# EAGLE design 2MosfetV2 (EAGLE 9.3.0)
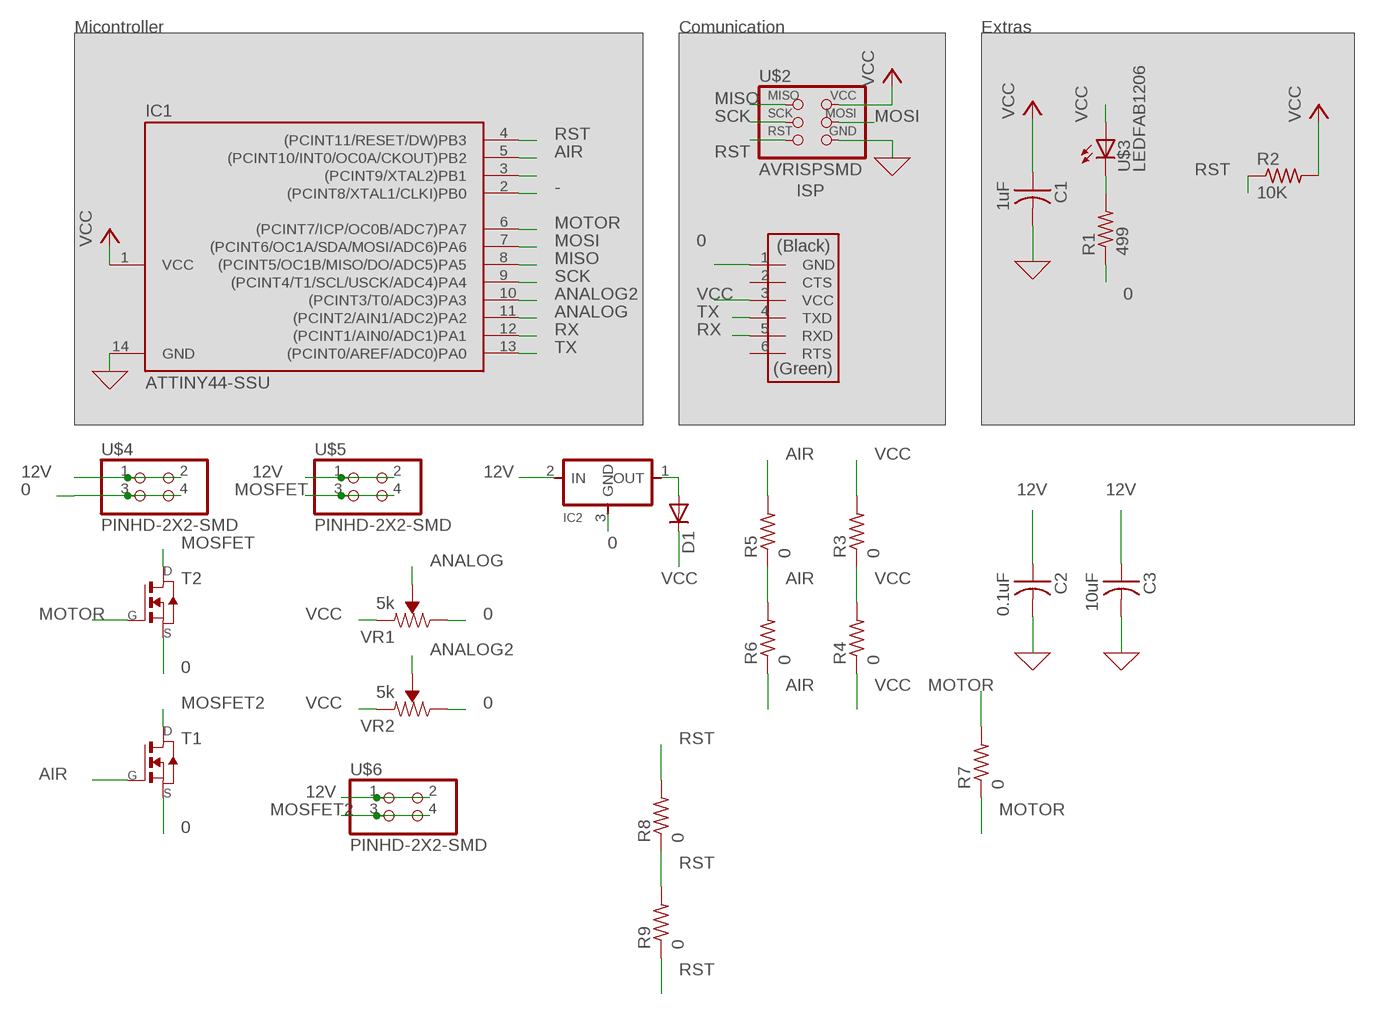
[diagram p0: schematic, sheet 1]

## Parts
C1  1uF  CAP-US1206FAB  [C1206FAB]
C2  0.1uF  CAP-US1206FAB  [C1206FAB]
C3  10uF  CAP-US1206FAB  [C1206FAB]
D1  DIODESOD123  [SOD123]
IC1  ATTINY44-SSU  [SOIC14]
IC2  REGULATORSOT23  [SOT23]
R1  499  RES-US1206FAB  [R1206FAB]
R2  10K  RES-US1206FAB  [R1206FAB]
R3  0  RES-US1206FAB  [R1206FAB]
R4  0  RES-US1206FAB  [R1206FAB]
R5  0  RES-US1206FAB  [R1206FAB]
R6  0  RES-US1206FAB  [R1206FAB]
R7  0  RES-US1206FAB  [R1206FAB]
R8  0  RES-US1206FAB  [R1206FAB]
R9  0  RES-US1206FAB  [R1206FAB]
T1  NMOSFETTO252  [TO252]
T2  NMOSFETTO252  [TO252]
U$1  FTDI-SMD-HEADER  [1X06SMD]
U$2  AVRISPSMD  [2X03SMD]
U$3  LEDFAB1206  [LED1206FAB]
U$4  PINHD-2X2-SMD  [2X02SMD]
U$5  PINHD-2X2-SMD  [2X02SMD]
U$6  PINHD-2X2-SMD  [2X02SMD]
VR1  5k  TRIMPOT-SMD-5MM-CLOSED-1/4W-20%  [TRIMPOT-SMD-5MM]
VR2  5k  TRIMPOT-SMD-5MM-CLOSED-1/4W-20%  [TRIMPOT-SMD-5MM]

## Nets
0: C1.2 C2.2 C3.2 IC1.14(GND) IC2.3(GND) R1.1 T1.2(S) T2.2(S) U$1.1(GND) U$2.6(GND) U$4.3 U$4.4 VR1.C(CW) VR2.C(CW) ; supply symbol labelled GND
12V: C2.1 C3.1 IC2.2(IN) U$4.1 U$4.2 U$5.1 U$5.2 U$6.1 U$6.2
-: IC1.2((PCINT8/XTAL1/CLKI)PB0)
AIR: IC1.5((PCINT10/INT0/OC0A/CKOUT)PB2) R5.1 R5.2 R6.1 R6.2 T1.1(G)
ANALOG: IC1.11((PCINT2/AIN1/ADC2)PA2) VR1.B(WIPER)
ANALOG2: IC1.10((PCINT3/T0/ADC3)PA3) VR2.B(WIPER)
MISO: IC1.8((PCINT5/OC1B/MISO/DO/ADC5)PA5) U$2.1(MISO)
MOSFET: T2.3(D) U$5.3 U$5.4
MOSFET2: T1.3(D) U$6.3 U$6.4
MOSI: IC1.7((PCINT6/OC1A/SDA/MOSI/ADC6)PA6) U$2.4(MOSI)
MOTOR: IC1.6((PCINT7/ICP/OC0B/ADC7)PA7) R7.1 R7.2 T2.1(G)
N$1: R1.2 U$3.2(C)
N$6: IC1.3((PCINT9/XTAL2)PB1)
N$11: D1.ANODE(A) IC2.1(OUT)
RST: IC1.4((PCINT11/RESET/DW)PB3) R2.1 R8.1 R8.2 R9.1 R9.2 U$2.5(RST)
RX: IC1.12((PCINT1/AIN0/ADC1)PA1) U$1.5(RXD)
SCK: IC1.9((PCINT4/T1/SCL/USCK/ADC4)PA4) U$2.3(SCK)
TX: IC1.13((PCINT0/AREF/ADC0)PA0) U$1.4(TXD)
VCC: C1.1 D1.CATHODE(C) IC1.1(VCC) R2.2 R3.1 R3.2 R4.1 R4.2 U$1.3(VCC) U$2.2(VCC) U$3.1(A) VR1.A(CCW) VR2.A(CCW)
Unconnected: U$1.2(CTS) U$1.6(RTS)

## Notes on the sheet
- Micontroller | Comunication | Extras
- ISP

## Library data of the parts
C1-C3 = fab:CAP-US
D1 = fab:DIODE: DIODE high speed (Philips)
IC1 = fab:ATTINY44
IC2 = fab:REGULATOR
R1-R9 = fab:RES-US: Resistor (US Symbol) Variants with postfix FAB are widened to allow the routing of internal traces
T1 T2 = fab:NMOSFET: MOS FET
U$1 = fab:FTDI-SMD-HEADER
U$2 = fab:AVRISP
U$3 = fab:LED: LED
U$4-U$6 = fab:PINHD-2X2-SMD
VR1 VR2 = SparkFun-Resistors:TRIMPOT: Trimming Potentiometer (Trimpot) Three-terminal potentiometers, with an adjustable wiper and two adjustable resistors. A pot can be used to create a configurable voltage divider, or as a variable resistor. "Trimpots" are a subset of potentiometers, usually intended for "set-and-forget" applications. They're often more delicate than standard potentiometers - rated for fewer turns. Variants PTH-KNOB - PTH Trimpot w/ finger-adjustable knob Trimpot 10K with Knob <https://www.sparkfun.com/products/9806> (COM-09806) Datasheet <http://www.sparkfun.com/datasheets/Components/General/TSR-3386.pdf> SMD-3MM-CLOSED-FRAME - SMD 3mm Square Closed-Frame Trimpot Used on e.g. EasyDriver - Stepper Motor Driver <https://www.sparkfun.com/products/12779> Datasheet <http://www.bitechnologies.com/pdfs/22.pdf> (22AR10KTR) SMD-5MM - SMD 5mm Square Closed-Frame Trimpot Used on e.g. IOIO-OTG - V2.2 <https://www.sparkfun.com/products/13613> Datasheet <http://www.vishay.com/docs/51008/ts53.pdf> (TS53YL502MR10) SMD-3MM-1/10W-25% - 3mm Square Open-Frame Trimpot Used on e.g. SparkFun Shapeoko <https://www.sparkfun.com/products/13899> Datasheet <http://www.bourns.com/docs/Product-Datasheets/TC33.pdf> (TC33X-2-103E); PROD_ID: RES-11156

## Board
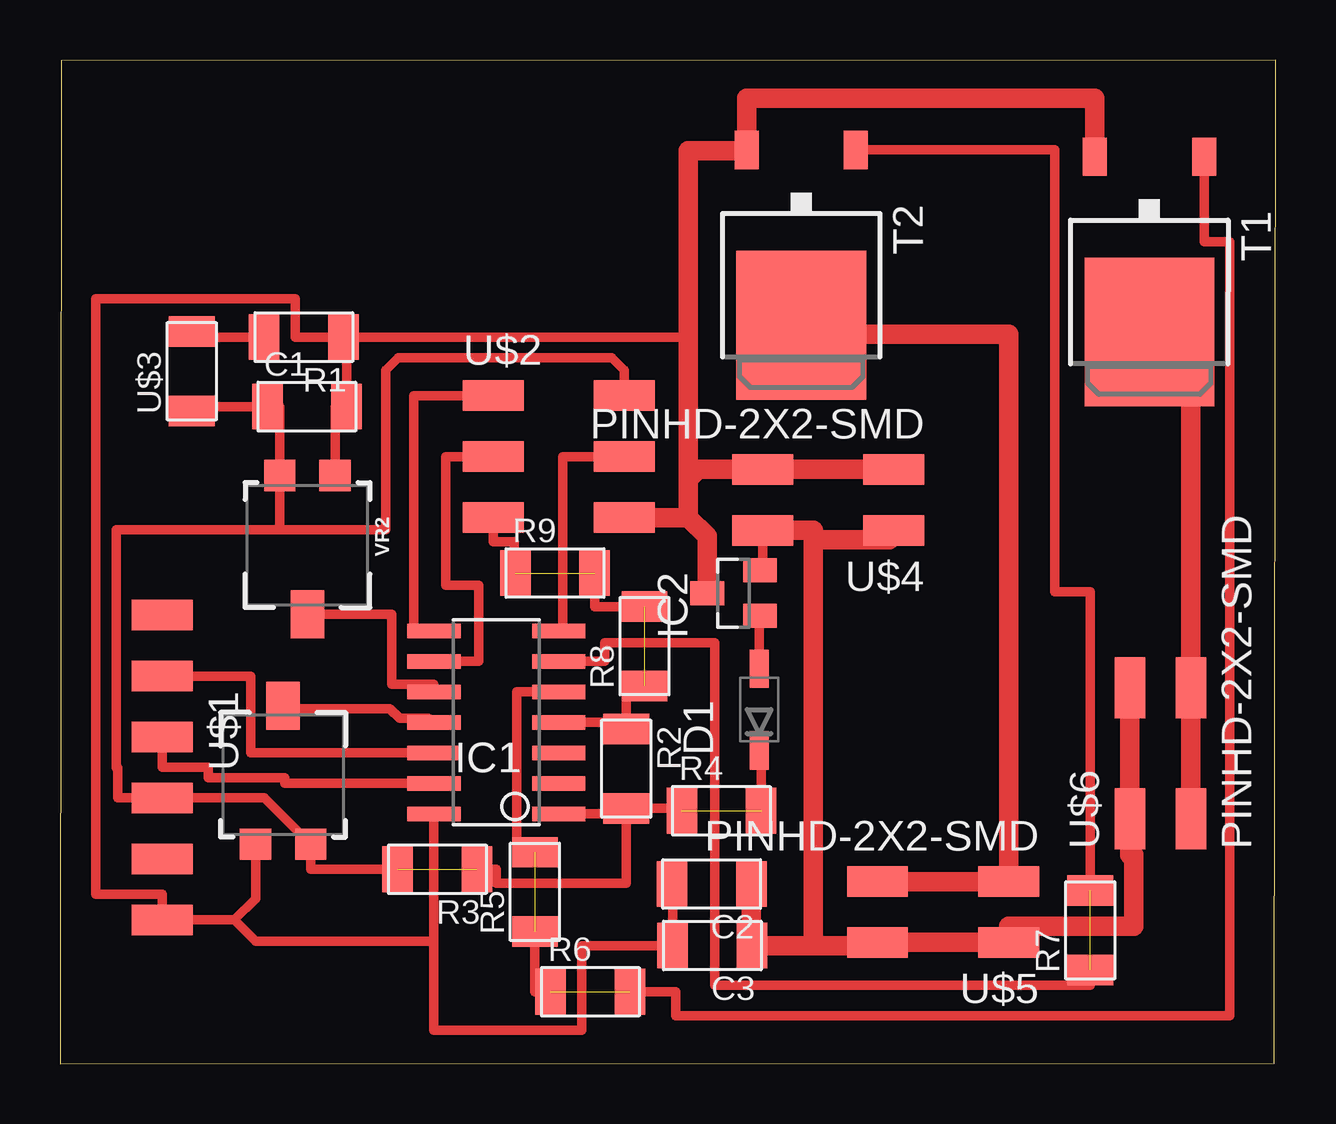
[diagram p1: board, top side]

Size 50.65 x 41.82 mm. Coordinates in mm from the lower left corner, seen from the top.
Outline: 0,0 50.6,0.03 50.65,41.82 0.05,41.8 0,0
Copper layers (1*16): Top 0.035mm / dielectric 1.5mm / Bottom 0.035mm
Design rules "default *": minimum track width 0.4mm, minimum drill 0.8mm, track to track 0.45mm, track to pad 0.45mm, pad to pad 0.45mm, via to via 0.45mm, smd to smd 0.45mm, copper to edge 40mil, drill to drill 6mil, minimum pad ring 10mil, minimum via ring 8mil, stop-mask expansion 4mil, vias tented up to drill 0mil, thermal gap 10mil

### Footprints (pad centres in the part's own frame; a part is rotated, then mirrored left to right if it is on the bottom)
C1206FAB = smd 1.27 x 1.905: 1 -1.651,0; 2 1.651,0
SOD123 = smd 1.6 x 0.8: ANODE 1.7,0; CATHODE -1.7,0
SOIC14 = smd 0.61 x 2.21: 1 -3.81,-2.603; 2 -2.54,-2.603; 3 -1.27,-2.603; 4 0,-2.603; 5 1.27,-2.603; 6 2.54,-2.603; 7 3.81,-2.603; 8 3.81,2.603; 9 2.54,2.603; 10 1.27,2.603; 11 0,2.603; 12 -1.27,2.603; 13 -2.54,2.603; 14 -3.81,2.603
SOT23 = smd 1 x 1.4: 1 -0.95,-1.1; 2 0.95,-1.1; 3 0,1.1
R1206FAB = smd 1.27 x 1.905: 1 -1.651,0; 2 1.651,0
TO252 = smd 1 x 1.6: 1 -2.28,-4.8; 2 2.28,-4.8 | smd 5.4 x 6.2: 3 0,2.5
1X06SMD = smd 2.54 x 1.27: 1 0,6.35; 2 0,3.81; 3 0,1.27; 4 0,-1.27; 5 0,-3.81; 6 0,-6.35
2X03SMD = smd 2.54 x 1.27: 1 -2.54,2.54; 2 2.92,2.54; 3 -2.54,0; 4 2.92,0; 5 -2.54,-2.54; 6 2.92,-2.54
LED1206FAB = smd 1.27 x 1.905: 1 -1.651,0; 2 1.651,0
2X02SMD = smd 2.54 x 1.27: 1 -2.54,1.27; 2 2.92,1.27; 3 -2.54,-1.27; 4 2.92,-1.27
TRIMPOT-SMD-5MM = smd 1.3 x 1.3: A 1.15,-2.54; C -1.15,-2.54 | smd 1.402 x 2: B 0,3.239

### Placement (x,y rotation side)
C1  10.29,27.38 0 top
C2  27.15,7.49 180 top
C3  27.18,4.93 180 top
D1  29.13,14.76 90 top
IC1  18.19,14.22 90 top
IC2  28.07,19.61 90 top
R1  10.16,30.28 180 top
R2  23.6,12.29 270 top
R3  15.72,8.1 180 top
R4  27.56,10.54 0 top
R5  19.79,7.16 90 top
R6  22.1,3 0 top
R7  42.93,5.56 90 top
R8  24.36,17.4 90 top
R9  20.62,20.45 0 top
T1  45.39,32.99 180 top
T2  30.89,33.27 180 top
U$1  4.27,12.34 180 top
U$2  20.6,25.3 0 top
U$3  5.49,28.85 90 top
U$4  32.21,23.49 180 top
U$5  36.98,6.32 180 top
U$6  45.85,12.75 90 top
VR1  9.3,11.68 0 top
VR2  10.31,21.97 180 top

### Tracks (layer width: path | path; a pad name or v marks a point on that pad's centre or on a via)
0
  Top 0.4: 7.26,5.99 U$1.1 4.27,7.07 1.5,7.07 1.5,31.88 9.79,31.88 9.79,30.28 R1.1 | 7.26,5.99 8.15,5.11 15.58,5.11 | VR2.C 11.46,27.38 C1.2 11.94,30.28 R1.1 | 15.58,5.11 IC1.14 | R1.1 26.19,30.28 26.19,30.38 | C2.2 25.53,7.49 C3.2 21.73,4.93 21.73,1.39 15.58,1.39 15.58,5.11 | 7.26,5.99 8.15,6.88 VR1.C
  Top 0.813: 26.19,22.76 26.19,24.33 | 26.19,24.33 26.19,30.38 26.19,38.05 28.61,38.05 T2.2 28.61,40.23 43.11,40.23 T1.2 | U$4.3 U$4.4 26.62,24.76 26.19,24.33 | IC2.3 26.97,21.98 26.19,22.76 | 26.19,22.76 U$2.6
12V
  Top 0.4: 34.55,22.43 U$4.1 | IC2.2 29.29,20.56 U$4.2
  Top 0.813: U$4.2 31.39,22.22 31.39,21.84 | 34.55,22.43 34.55,21.84 31.39,21.84 | C2.1 28.8,4.93 C3.1 31.39,4.93 | 31.39,4.93 34.06,4.93 U$5.2 U$5.1 39.52,5.72 44.73,5.72 44.73,8.7 44.58,8.7 U$6.1 U$6.2 | 31.39,4.93 31.39,21.84
AIR  (2 unrouted)
  Top 0.4: R5.2 19.03,8.81 19.03,15.49 IC1.5 | R5.1 19.79,3 R6.1 | R6.2 25.65,3 25.65,2.01 48.74,2.01 48.74,34.24 47.67,34.24 T1.1
ANALOG
  Top 0.4: VR1.B 9.35,14.79 13.75,14.79 14.15,14.39 15.35,14.39 IC1.11
ANALOG2
  Top 0.4: IC1.10 15.58,15.81 13.83,15.81 13.83,18.73 VR2.B
MISO
  Top 0.4: IC1.8 14.73,18.03 14.73,27.84 U$2.1
MOSFET
  Top 0.813: T2.3 30.89,30.39 39.52,30.39 U$5.3 U$5.4
MOSFET2
  Top 0.813: U$6.3 U$6.4 47.12,30.49 T1.3
MOSI
  Top 0.4: IC1.7 20.95,17.99 20.95,25.3 U$2.4
MOTOR  (1 unrouted)
  Top 0.4: 20.95,16.79 IC1.6 22.71,16.76 22.71,17.55 27.29,17.55 27.29,3.27 42.93,3.27 R7.1 | T2.1 41.45,38.07 41.45,19.66 42.93,19.66 R7.2
N$1
  Top 0.4: R1.2 5.49,30.28 U$3.2
N$11
  Top 0.4: IC2.1 29.13,18.63 D1.ANODE
RST  (2 unrouted)
  Top 0.4: 20.79,14.17 IC1.4 23.32,14.22 R2.1 23.6,15.75 R8.1 | 18.06,22.73 U$2.5 18.06,21.74 18.92,21.74 18.92,20.45 R9.1 | R8.2 22.28,19.05 R9.2
RX
  Top 0.4: IC1.12 7.95,12.95 7.95,16.15 U$1.5
SCK
  Top 0.4: U$2.3 16.08,25.3 16.08,19.94 17.45,19.94 17.45,16.76 IC1.9
TX
  Top 0.4: U$1.4 4.27,12.36 6.19,12.36 6.19,11.92 9.37,11.92 9.37,11.68 IC1.13
VCC  (2 unrouted)
  Top 0.4: 23.22,28.11 U$2.2 23.52,28.91 23,29.43 14.09,29.43 13.56,28.91 13.56,22.25 9.16,22.25 | 23.23,10.8 R2.2 | 20.95,10.39 IC1.1 23.6,10.41 R2.2 | R3.2 10.45,8.1 VR1.A 8.52,11.07 U$1.3 2.4,11.07 2.4,12.33 2.35,12.33 2.35,22.25 9.16,22.25 | R2.2 25.91,10.64 R4.1 | D1.CATHODE 29.21,13.06 R4.2 | 9.16,22.25 VR2.A 9.16,27.38 C1.1 5.49,27.38 U$3.1 | R3.1 18.18,8.1 18.18,7.53 23.6,7.53 R2.2